# EAGLE design BoardSheme (EAGLE 8.5.2)
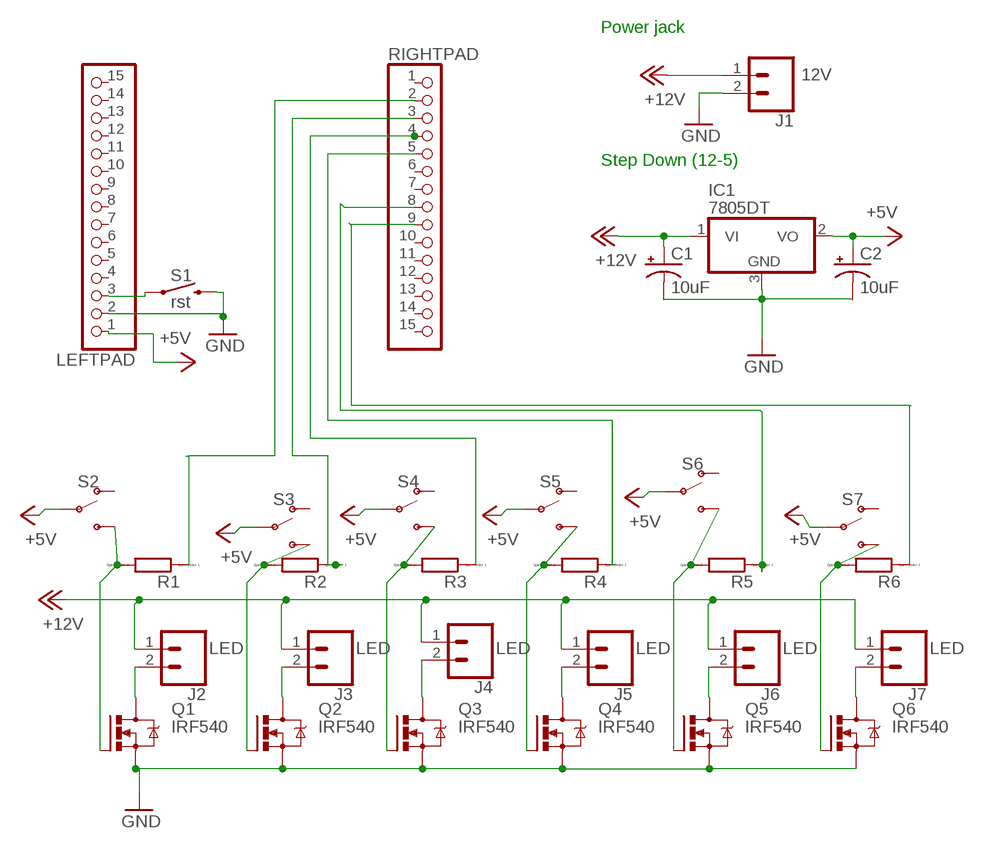
[diagram p0: schematic, sheet 1]

## Parts
C1  10uF  10UF-POLAR-RADIAL-2.5MM-25V-20%  [CPOL-RADIAL-2.5MM-5MM]
C2  10uF  10UF-POLAR-RADIAL-2.5MM-25V-20%  [CPOL-RADIAL-2.5MM-5MM]
IC1  7805DT  [TO252]
J1  CONN_02PTH4  [1X02_XTRA_BIG]
J2  CONN_02PTH4  [1X02_XTRA_BIG]
J3  CONN_02PTH4  [1X02_XTRA_BIG]
J4  CONN_02PTH4  [1X02_XTRA_BIG]
J5  CONN_02PTH4  [1X02_XTRA_BIG]
J6  CONN_02PTH4  [1X02_XTRA_BIG]
J7  CONN_02PTH4  [1X02_XTRA_BIG]
LEFTPAD  PINHD-1X15  [1X15]
Q1  IRF540  [TO220BV]
Q2  IRF540  [TO220BV]
Q3  IRF540  [TO220BV]
Q4  IRF540  [TO220BV]
Q5  IRF540  [TO220BV]
Q6  IRF540  [TO220BV]
R1  RR1206  [R1206]
R2  RR1206  [R1206]
R3  RR1206  [R1206]
R4  RR1206  [R1206]
R5  RR1206  [R1206]
R6  RR1206  [R1206]
RIGHTPAD  PINHD-1X15  [1X15]
S1  rst  MOMENTARY-SWITCH-SPST-PTH-6.0MM-KIT  [TACTILE_SWITCH_PTH_6.0MM_KIT]
S2  SWITCH-SPDT-PTH-11.6X4.0MM  [SWITCH_SPDT_PTH_11.6X4.0MM]
S3  SWITCH-SPDT-PTH-11.6X4.0MM  [SWITCH_SPDT_PTH_11.6X4.0MM]
S4  SWITCH-SPDT-PTH-11.6X4.0MM  [SWITCH_SPDT_PTH_11.6X4.0MM]
S5  SWITCH-SPDT-PTH-11.6X4.0MM  [SWITCH_SPDT_PTH_11.6X4.0MM]
S6  SWITCH-SPDT-PTH-11.6X4.0MM  [SWITCH_SPDT_PTH_11.6X4.0MM]
S7  SWITCH-SPDT-PTH-11.6X4.0MM  [SWITCH_SPDT_PTH_11.6X4.0MM]

## Nets
+5V: C2.1(+) IC1.2(VO) LEFTPAD.1 S2.2(P) S3.2(P) S4.2(P) S5.2(P) S6.2(P) S7.2(P)
+12V: C1.1(+) IC1.1(VI) J1.1 J2.1 J3.1 J4.1 J5.1 J6.1 J7.1
GND: C1.2(-) C2.2(-) IC1.3(GND) J1.2 LEFTPAD.2 Q1.S Q2.S Q3.S Q4.S Q5.S Q6.S S1.3
N$1: LEFTPAD.3 S1.1
N$2: Q1.G R1.2 S2.3(S)
N$3: J2.2 Q1.D
N$4: J3.2 Q2.D
N$5: J4.2 Q3.D
N$6: J5.2 Q4.D
N$7: J6.2 Q5.D
N$8: J7.2 Q6.D
N$9: Q2.G R2.2 S3.3(S)
N$10: Q3.G R3.2 S4.3(S)
N$11: Q4.G R4.2 S5.3(S)
N$12: Q5.G R5.2 S6.3(S)
N$13: Q6.G R6.2 S7.3(S)
N$14: R3.1 RIGHTPAD.4
N$15: R2.1 RIGHTPAD.3
N$16: R1.1 RIGHTPAD.2
N$17: R4.1 RIGHTPAD.5
N$18: R5.1 RIGHTPAD.8
N$19: R6.1 RIGHTPAD.9
N$20: RIGHTPAD.1
Unconnected: LEFTPAD.4 LEFTPAD.5 LEFTPAD.6 LEFTPAD.7 LEFTPAD.8 LEFTPAD.9 LEFTPAD.10 LEFTPAD.11 LEFTPAD.12 LEFTPAD.13 LEFTPAD.14 LEFTPAD.15 RIGHTPAD.6 RIGHTPAD.7 RIGHTPAD.10 RIGHTPAD.11 RIGHTPAD.12 RIGHTPAD.13 RIGHTPAD.14 RIGHTPAD.15 S2.1(O) S3.1(O) S4.1(O) S5.1(O) S6.1(O) S7.1(O)

## Notes on the sheet
- Power jack
- Step Down (12-5)

## Library data of the parts
C1 C2 = SparkFun-Capacitors:10UF-POLAR: 10.0µF polarized capacitors A capacitor is a passive two-terminal electrical component used to store electrical energy temporarily in an electric field.; PROD_ID: CAP-08440
IC1 = linear:78*: Positive VOLTAGE REGULATOR Source: http://cache.national.com/ds/LM/LM78L05.pdf http://www.fairchildsemi.com/ds/LM/LM7805.pdf
J1 = SparkFun-Connectors:CONN_02: Multi connection point. Often used as Generic Header-pin footprint for 0.1 inch spaced/style header connections On any of the 0.1 inch spaced packages, you can populate with these: Break Away Headers - Straight <https://www.sparkfun.com/products/116> (PRT-00116) Break Away Male Headers - Right Angle <https://www.sparkfun.com/products/553> (PRT-00553) Female Headers <https://www.sparkfun.com/products/115> (PRT-00115) Break Away Headers - Machine Pin <https://www.sparkfun.com/products/117> (PRT-00117) Break Away Female Headers - Swiss Machine Pin <https://www.sparkfun.com/products/743> (PRT-00743) For SCREWTERMINALS and SPRING TERMINALS visit here: Screw Terimnals on SparkFun.com <https://www.sparkfun.com/search/results?term=Screw+Terminals> (5mm/3.5mm/2.54mm spacing) This device is also useful as a general connection point to wire up your design to another part of your project. Our various solder wires solder well into these plated through hole pads. Hook-Up Wire - Assortment (Stranded, 22 AWG) <https://www.sparkfun.com/products/11375> (PRT-11375) Hook-Up Wire - Assortment (Solid Core, 22 AWG) <https://www.sparkfun.com/products/11367> (PRT-11367) View the entire wire category on our website here <https://www.sparkfun.com/categories/141> Special notes: Molex polarized connector foot print use with: PRT-08233 with associated crimp pins and housings. 2.54_SCREWTERM for use with PRT-10571. 3.5mm Screw Terminal footprints for PRT-08084 5mm Screw Terminal footprints for use with PRT-08432; SPICEPREFIX: J; VOLTAGE: 12V
J2-J7 = SparkFun-Connectors:CONN_02: Multi connection point. Often used as Generic Header-pin footprint for 0.1 inch spaced/style header connections On any of the 0.1 inch spaced packages, you can populate with these: Break Away Headers - Straight <https://www.sparkfun.com/products/116> (PRT-00116) Break Away Male Headers - Right Angle <https://www.sparkfun.com/products/553> (PRT-00553) Female Headers <https://www.sparkfun.com/products/115> (PRT-00115) Break Away Headers - Machine Pin <https://www.sparkfun.com/products/117> (PRT-00117) Break Away Female Headers - Swiss Machine Pin <https://www.sparkfun.com/products/743> (PRT-00743) For SCREWTERMINALS and SPRING TERMINALS visit here: Screw Terimnals on SparkFun.com <https://www.sparkfun.com/search/results?term=Screw+Terminals> (5mm/3.5mm/2.54mm spacing) This device is also useful as a general connection point to wire up your design to another part of your project. Our various solder wires solder well into these plated through hole pads. Hook-Up Wire - Assortment (Stranded, 22 AWG) <https://www.sparkfun.com/products/11375> (PRT-11375) Hook-Up Wire - Assortment (Solid Core, 22 AWG) <https://www.sparkfun.com/products/11367> (PRT-11367) View the entire wire category on our website here <https://www.sparkfun.com/categories/141> Special notes: Molex polarized connector foot print use with: PRT-08233 with associated crimp pins and housings. 2.54_SCREWTERM for use with PRT-10571. 3.5mm Screw Terminal footprints for PRT-08084 5mm Screw Terminal footprints for use with PRT-08432; SPICEPREFIX: J; VOLTAGE: LED
LEFTPAD RIGHTPAD = pinhead:PINHD-1X15: PIN HEADER
Q1-Q6 = transistor-power:IRF540: HEXFET Power MOSFET
R1-R6 = eagle-ltspice:R: RESISTOR, European symbol; SPICEMODEL: NONE; SPICEPREFIX: R
S1 = SparkFun-Switches:MOMENTARY-SWITCH-SPST: Momentary Switch (Pushbutton) - SPST Normally-open (NO) SPST momentary switches (buttons, pushbuttons). Variants PTH-12MM - 12mm square, through-hole Momentary Pushbutton Switch - 12mm Square <https://www.sparkfun.com/products/9190> (COM-09190) PTH-6.0MM, PTH-6.0MM-KIT - 6.0mm square, through-hole Mini Pushbutton Switch <https://www.sparkfun.com/products/97> (COM-00097) KIT package intended for soldering kit's - only one side of pads' copper is exposed. PTH-RIGHT-ANGLE-KIT - Right-angle, through-hole Right Angle Tactile Button <https://www.sparkfun.com/products/10791> - Used on SparkFun BigTime Watch Kit <https://www.sparkfun.com/products/11734> SMD-12MM - 12mm square, surface-mount Tactile Button - SMD (12mm) <https://www.sparkfun.com/products/12993> (COM-12993) Used on SparkFun PicoBoard <https://www.sparkfun.com/products/11888> SMD-4.5MM - 4.5mm Square Trackball Switch Used on SparkFun Blackberry Trackballer Breakout <https://www.sparkfun.com/products/13169> SMD-4.6MMX2.8MM - 4.60mm x 2.80mm, surface mount Used on SparkFun SAMD21 Mini Breakout <https://www.sparkfun.com/products/13664> SMD-5.2MM, SMD-5.2-REDUNDANT - 5.2mm square, surface-mount Mini Pushbutton Switch - SMD <https://www.sparkfun.com/products/8720> (COM-08720) Used on Arduino Pro Mini <https://www.sparkfun.com/products/11114> REDUNDANT package connects both switch circuits together SMD-6.0X3.5MM - 6.0 x 3.5mm, surface mount Momentary Reset Switch SMD <https://www.sparkfun.com/products/8229> (COM-08229) SMD-6.2MM-TALL - 6.2mm square, surface mount Tactile Button - SMD (6mm) <https://www.sparkfun.com/products/12992> Used on SparkFun Digital Sandbox <https://www.sparkfun.com/products/12651> SMD-RIGHT-ANGLE - Right-angle, surface mount Used on SparkFun Block for Intel® Edison - Arduino <https://www.sparkfun.com/products/13036>; PROD_ID: SWCH-08441; SF_SKU: COM-00097
S2-S7 = SparkFun-Switches:SWITCH-SPDT: Single Pole, Double Throw (SPDT) Switch Single-pole, double-throw (SPDT) switch. Variant Overview SMD-AYZ0202 Surface Mount DPDT Switch <https://www.sparkfun.com/products/597> (COM-00597) Used on e.g. LilyPad Arduino USB - ATmega32U4 Board <https://www.sparkfun.com/products/12049> PTH-11.6X4.0MM SPDT Mini Power Switch <https://www.sparkfun.com/products/102> (COM-00102) Used on e.g. SparkFun Simon Says - Through-Hole Soldering Kit <https://www.sparkfun.com/products/10547> (KIT-10547) PTH-11.6X4.0MM-KIT KIT version of SPDT Mini Power Switch - Simplifies soldering by removing tStop of switch pins - only one side can be soldered. PTH-11.6X4.0MM-LOCK LOCK version of SPDT Mini Power Switch - Offset pins hold switch in place for easier soldering. SMD-RIGHT-ANGLE Surface Mount Right Angle Switch <https://www.sparkfun.com/products/10860> (COM-10860) Used on e.g. SparkFun ESP8266 Thing <https://www.sparkfun.com/products/13231>; PROD_ID: SWCH-08261; SF_SKU: COM-00102

## Module POWER
Ports: 

### Library data of the parts

## Board
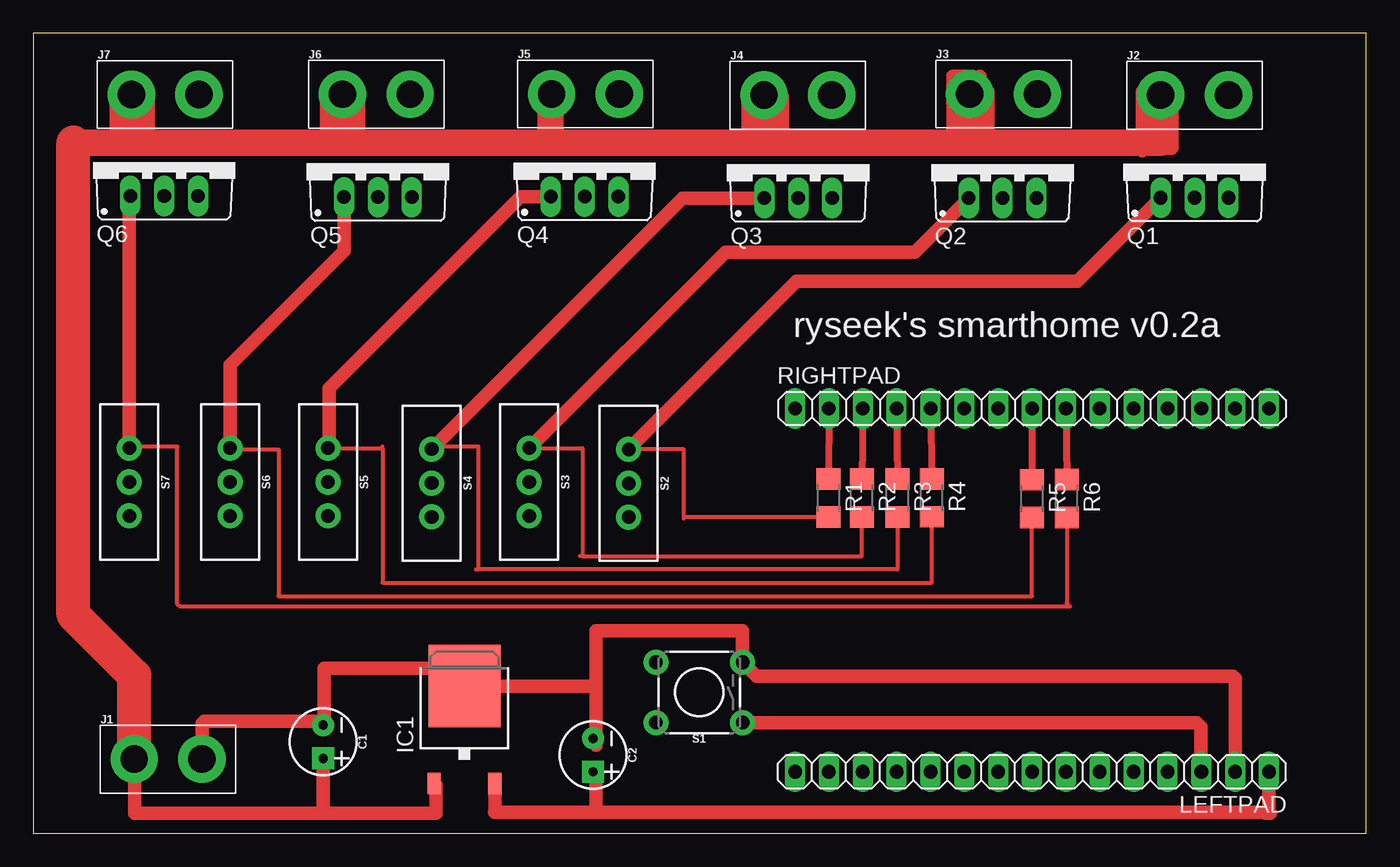
[diagram p1: board, top side]
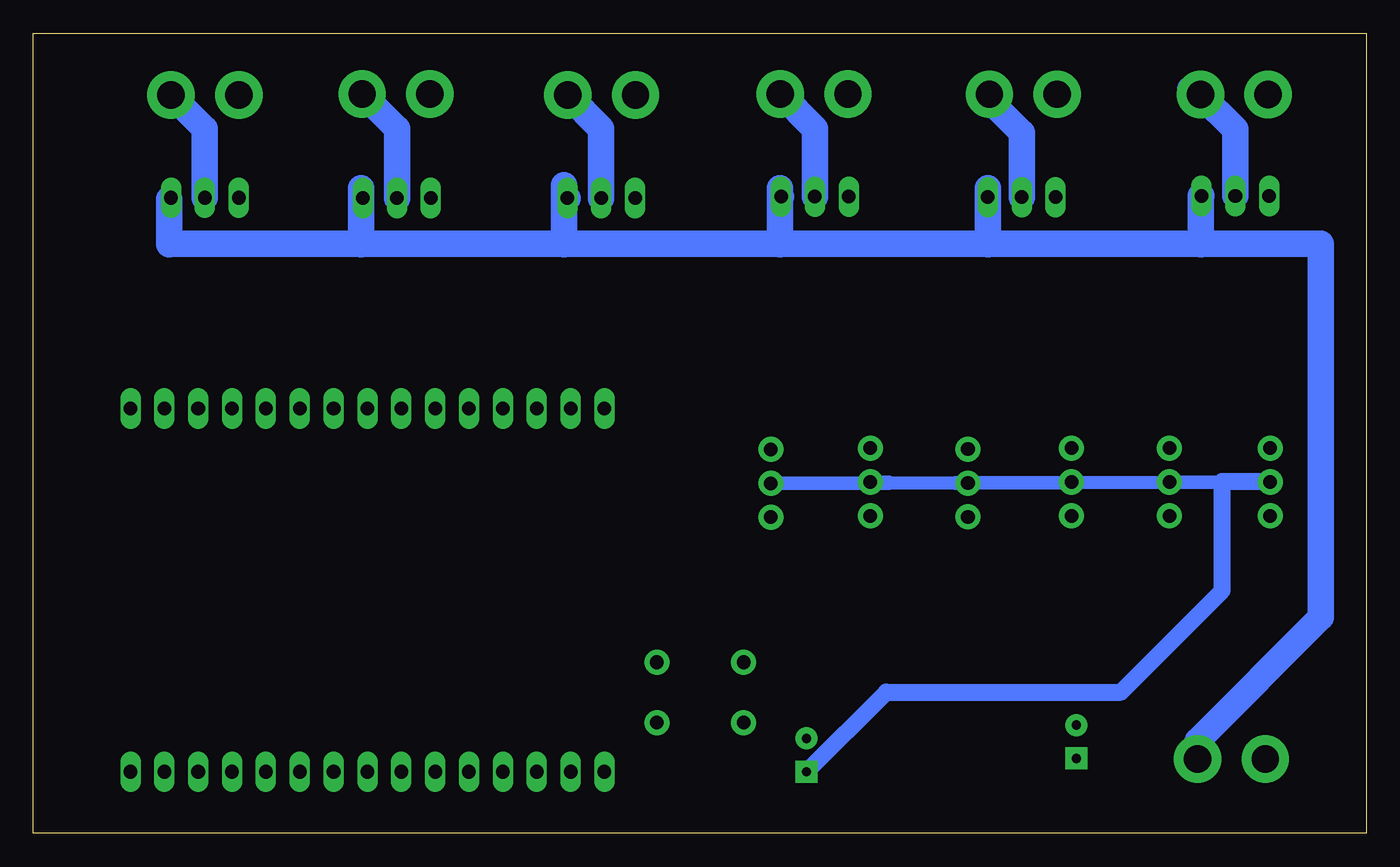
[diagram p2: board, bottom side, seen from below]

Size 100 x 60 mm. Coordinates in mm from the lower left corner, seen from the top.
Outline: 0,0 100,0 100,60 0,60 0,0
Copper layers (1*16): Top 0.035mm / dielectric 1.5mm / Bottom 0.035mm
Design rules "default": minimum track width 6mil, minimum drill 0.35mm, track to track 6mil, track to pad 6mil, pad to pad 6mil, via to via 6mil, smd to smd 6mil, copper to edge 40mil, drill to drill 6mil, minimum pad ring 10mil, minimum via ring 8mil, stop-mask expansion 4mil, vias tented up to drill 0mil, thermal gap 10mil

### Footprints (pad centres in the part's own frame; a part is rotated, then mirrored left to right if it is on the bottom)
CPOL-RADIAL-2.5MM-5MM = drill 0.7 pad 1.651 square: 1 1.25,0 | drill 0.7 pad 1.651: 2 -1.25,0
TO252 = smd 1 x 1.6: 1 -2.28,-4.8; 2 2.28,-4.8 | smd 5.4 x 6.2: 3 0,2.5
1X02_XTRA_BIG = drill 2.057 pad 3.556: 1 -2.54,0; 2 2.54,0
1X15 = drill 1.016 long: 1 -17.78,0; 2 -15.24,0; 3 -12.7,0; 4 -10.16,0; 5 -7.62,0; 6 -5.08,0; 7 -2.54,0; 8 0,0; 9 2.54,0; 10 5.08,0; 11 7.62,0; 12 10.16,0; 13 12.7,0; 14 15.24,0; 15 17.78,0
TO220BV = drill 1.016 long: D 0,-2.54; G -2.54,-2.54; S 2.54,-2.54
R1206 = smd 1.6 x 1.803: 1 -1.422,0; 2 1.422,0
TACTILE_SWITCH_PTH_6.0MM_KIT = drill 1.016 pad 1.88: 1 -3.251,2.261; 2 3.251,2.261; 3 -3.251,-2.261; 4 3.251,-2.261
SWITCH_SPDT_PTH_11.6X4.0MM = drill 1.016 pad 1.88: 1 0,2.54; 2 0,0; 3 0,-2.54

### Placement (x,y rotation side)
C1  21.74,6.87 270 top
C2  41.99,5.87 270 top
IC1  32.35,8.55 0 top
J1  10.11,5.56 0 top
J2  87.12,55.36 0 top
J3  72.79,55.46 0 top
J4  57.36,55.36 0 top
J5  41.42,55.46 0 top
J6  25.73,55.43 0 top
J7  9.89,55.41 0 top
LEFTPAD  74.93,4.62 180 top
Q1  87.13,50.21 0 top
Q2  72.72,50.19 0 top
Q3  57.39,50.19 0 top
Q4  41.36,50.29 0 top
Q5  25.85,50.25 0 top
Q6  9.82,50.35 0 top
R1  59.67,25.14 270 top
R2  62.16,25.15 270 top
R3  64.83,25.15 270 top
R4  67.41,25.16 270 top
R5  74.93,25.1 270 top
R6  77.53,25.12 270 top
RIGHTPAD  74.93,31.86 0 top
S1  49.96,10.57 180 top
S2  44.66,26.25 180 top
S3  37.21,26.35 180 top
S4  29.88,26.27 180 top
S5  22.11,26.35 180 top
S6  14.76,26.35 180 top
S7  7.21,26.35 180 top

### Tracks (layer width: path | path; a pad name or v marks a point on that pad's centre or on a via)
+5V
  Top 1.016: 44.56,26.35 S2.2 | IC1.2 34.63,1.63 34.6,1.6 42.2,1.6 | 42.2,1.6 42.2,4.41 C2.1 | 42.2,1.6 92.4,1.6 92.48,1.52 92.8,1.52 92.71,1.61 LEFTPAD.1
  Bottom 1.016: S7.2 15.2,26.33 | 15.2,26.33 22.2,26.31 | 22.2,26.31 29.8,26.29 | 29.8,26.29 30.8,26.29 | 30.8,26.29 35.8,26.27 | 35.8,26.27 S2.2 | S6.2 15.2,26.35 15.2,26.33 | S5.2 22.2,26.35 22.2,26.31 | 29.8,26.29 29.8,26.27 S4.2 30.8,26.27 30.8,26.29 | S3.2 35.8,26.35 35.8,26.27
  Bottom 1.27: C2.1 36.01,10.6 18.4,10.6 10.8,18.2 10.8,26.4 7.26,26.4 S7.2
+12V
  Top 1.016: J1.1 7.6,5.53 7.6,1.52 21.8,1.52 | 21.8,1.52 30.2,1.52 30.2,3.62 IC1.1 | C1.1 21.74,1.58 21.8,1.52 | 6,51.8 6.2,51.8 6.2,55.4 8.6,55.4 | 8.6,52.4 8.6,55.4 | 8.6,55.4 8.6,55.41 J7.1 | 53.6,51.8 53.6,55.36 J4.1 54.82,55.2 56.2,55.2 56.2,51.8 | J3.1 69.6,55.46 | 69.6,55.46 69,55.46 | 69,55.46 69,51.8 | 70.6,51.8 71.6,51.8 71.6,55.46 | 71.6,55.6 71.6,55.46 | 71.6,55.46 70.6,55.46 | 70.6,55.46 J3.1 | 70.25,51.8 69.6,51.8 69.6,55.46 | 70.6,51.8 70.25,51.8 | 70.25,51.8 J3.1 | 70.6,51.8 70.6,55.46 | J3.1 70.25,56.8 | 70.25,56.8 70.4,56.8 | 70.25,56.8 69,56.8 69,55.46 | J3.1 71,55.46 71,56.2 | 71,56.8 71,56.2 | 71,56.2 70.25,56.2 | 69.6,56.2 70.25,56.2 | 70.25,56.2 J3.1 | 83.2,51.4 85.4,51.4 85.4,55.6 83.2,55.6 83.2,51.8 83.2,51.4 | 83.2,51.4 83.2,51.2 | J6.1 22,55.43 22,52.6 24.4,52.6 24.4,55.4 23.19,55.4 J6.1
  Top 2: 3,51.8 6,51.8 7.4,51.8 | 7.4,51.8 23.4,51.8 | 23.4,51.8 38.8,51.8 | 38.8,51.8 53.6,51.8 55,51.8 | 55,51.8 56.2,51.8 69,51.8 70.6,51.8 83.2,51.8 84.6,51.8 84.58,51.82 J2.1 | J4.1 54.82,51.98 55,51.8 | J5.1 38.8,55.38 38.8,51.8 | J6.1 23.4,55.22 23.4,51.8 | J7.1 7.4,55.36 7.4,51.8
  Top 2.54: J1.1 7.57,11.83 3,16.4 3,51.8
GND
  Top 1.016: 42.2,11.2 42.05,11.05 IC1.3 32.35,12.4 31.6,12.4 | 42.2,11.2 42.2,6.6 41.99,6.81 C2.2 | 31.6,12.4 21.8,12.4 21.8,8.18 C1.2 21.46,8.4 12.8,8.4 12.65,8.25 J1.2 | 31.6,12.4 31.8,12.2 | LEFTPAD.2 90.17,11.63 90,11.8 54.24,11.8 S1.3 53.21,15.2 42.2,15.2 42.2,11.2
  Bottom 1.27: 89.8,47.54 Q1.S | Q2.S 75.4,47.51 | 44,44.2 43.9,44.3
  Bottom 2: J1.2 12.65,6.95 3.4,16.2 3.4,44.2 12.4,44.2 | 12.4,44.2 28.4,44.2 | 28.4,44.2 44,44.2 60.2,44.2 | 60.2,44.2 75.4,44.2 | 75.4,44.2 89.8,44.2 89.8,47.54 | 75.4,44.2 75.4,47.51 75.4,48.4 | 60.2,44.2 60.2,47.65 | 60.2,48.6 60.2,47.65 | 60.2,47.65 Q3.S | 43.9,44.3 44,44.3 44,47.75 | 44,48.4 44,47.75 | 44,47.75 Q4.S | 28.4,44.2 28.4,48.4 28.39,48.4 Q5.S | 12.4,44.2 12.4,47.81 Q6.S
N$1
  Top 1.016: S1.1 87.29,8.31 87.6,8 87.6,4.65 LEFTPAD.3
N$2
  Top 0.305: R1.2 48.8,23.72 | 48.8,23.72 48.8,23.6 | S2.3 48.8,28.79 48.8,23.72
  Top 1.016: S2.3 57.27,41.4 78.32,41.4 Q1.G
N$3
  Bottom 2: Q1.D 87.13,52.83 J2.2
N$4
  Bottom 2: Q2.D 72.72,52.85 J3.2
N$5
  Bottom 2: Q3.D 57.39,52.85 J4.2
N$6
  Bottom 2: Q4.D 41.36,52.86 J5.2
N$7
  Bottom 2: Q5.D 25.85,52.55 28.27,54.97 J6.2
N$8
  Bottom 2: J7.2 9.82,52.8 Q6.D | J7.2 12.82,55.8 | 12.82,55.8 13.2,55.8 | 12.82,55.8 12.43,55.8 J7.2
N$9
  Top 0.305: S3.3 41.2,28.89 41.2,20.8 | 41.2,20.8 41,20.8 | 41.2,20.8 62.16,20.8 R2.2
  Top 1.016: S3.3 51.92,43.6 66.13,43.6 Q2.G
N$10
  Top 0.305: R3.2 64.83,19.8 33.4,19.8 | 33.2,19.8 33.4,19.8 | 33.4,19.8 33.4,29 29.88,29 S4.3
  Top 1.016: S4.3 48.72,47.65 Q3.G
N$11
  Top 0.305: S5.3 26.2,28.89 | 26.2,28.89 26.2,29 | 26.2,28.89 26.2,18.8 67.41,18.8 R4.2
  Top 1.016: S5.3 22.2,28.98 22.2,33.4 36.55,47.75 Q4.G
N$12
  Top 0.305: S6.3 14.85,28.8 18.4,28.8 18.4,17.8 74.93,17.8 R5.2
  Top 1.016: S6.3 14.76,35.16 23.31,43.71 Q5.G
N$13
  Top 0.305: R6.2 77.53,17.27 77.8,17 11,17 10.8,17.2 10.8,29 7.32,29 S7.3
  Top 1.016: S7.3 7.21,47.74 Q6.G
N$14
  Top 0.508: RIGHTPAD.4 R3.1
N$15
  Top 0.508: RIGHTPAD.3 R2.1
N$16
  Top 0.508: RIGHTPAD.2 R1.1
N$17
  Top 0.508: RIGHTPAD.5 R4.1
N$18
  Top 0.508: RIGHTPAD.8 R5.1
N$19
  Top 0.508: RIGHTPAD.9 R6.1

### Text on the board
tNames: ryseek's smarthome v0.2a